# Altium schematic sheet HornRelay.SchDoc
size A4
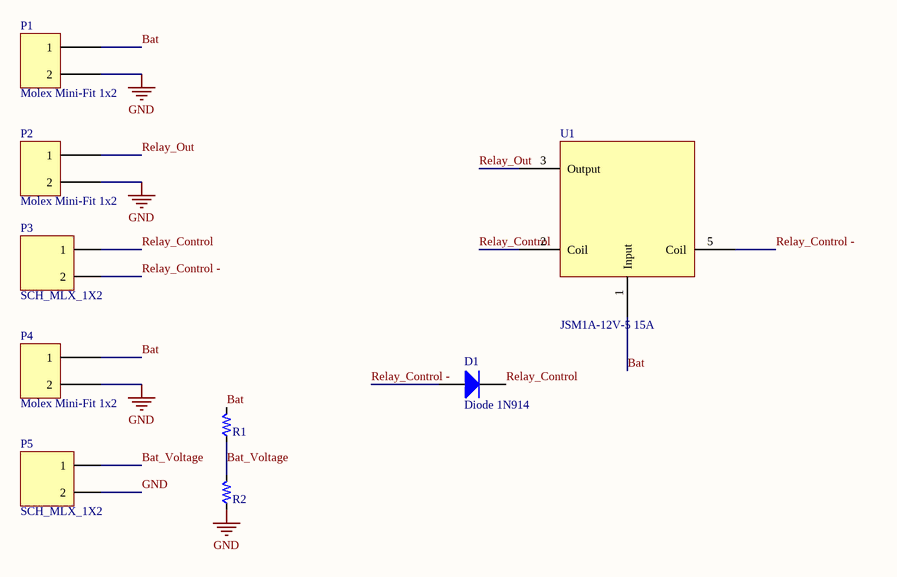
[diagram p0: HornRelay.SchDoc]

## Parts
D1  Diode 1N914  [DO-35]
P1  Molex Mini-Fit 1x2  [Molex Mini-Fit Jr 2x1]
P2  Molex Mini-Fit 1x2  [Molex Mini-Fit Jr 2x1]
P3  SCH_MLX_1X2  [PCB_MLX_MICROFIT_1X2]
P4  Molex Mini-Fit 1x2  [Molex Mini-Fit Jr 2x1]
P5  SCH_MLX_1X2  [PCB_MLX_MICROFIT_1X2]
R1  4.7k  [PCB_GENERIC_SMD_0603]  (value not drawn)
R2  1k  [PCB_GENERIC_SMD_0603]  (value not drawn)
U1  JSM1A-12V-5 15A  [JSM1A-12V-5 15A]

## Nets
GND: P1.2 P2.2 P4.2 P5.2 R2.1
Bat: P1.1 P4.1 R1.2 U1.1(Input)
Bat_Voltage: P5.1 R1.1 R2.2
Relay_Control: D1.2(K) P3.1 U1.2(Coil)
Relay_Control -: D1.1(A) P3.2 U1.5(Coil)
Relay_Out: P2.1 U1.3(Output)

## Library data of the parts
D1 = Diode 1N914: High Conductance Fast Diode; Published: 8-Jun-2000; LatestRevisionDate: 17-Jul-2002; LatestRevisionNote: Re-released for DXP Platform.; DatasheetVersion: 1997; PackageReference: DO-35; Publisher: Altium Limited; PackageDescription: Diode, Axial; Body 3.8 x 1.9 mm (LxDia. max), Lead Dia. 0.53 mm (max); Code_JEDEC: DO-204-AH; ComponentLink1Description: Manufacturer Link; ComponentLink1URL: http://www.fairchildsemi.com/; ComponentLink2Description: Datasheet; ComponentLink2URL: http://www.fairchildsemi.com/ds/1N%2F1N4448.pdf
R1 R2 = SCH_GENERIC_RESISTOR_0603: Generic SMD resistor 0603; Resistance: *
U1 = JSM1A-12V-5 15A: 15A Relay 255-2815-ND; pin to pad: 1>5 3>1 5>3